# EAGLE design caja_universal (EAGLE 7.7.0)
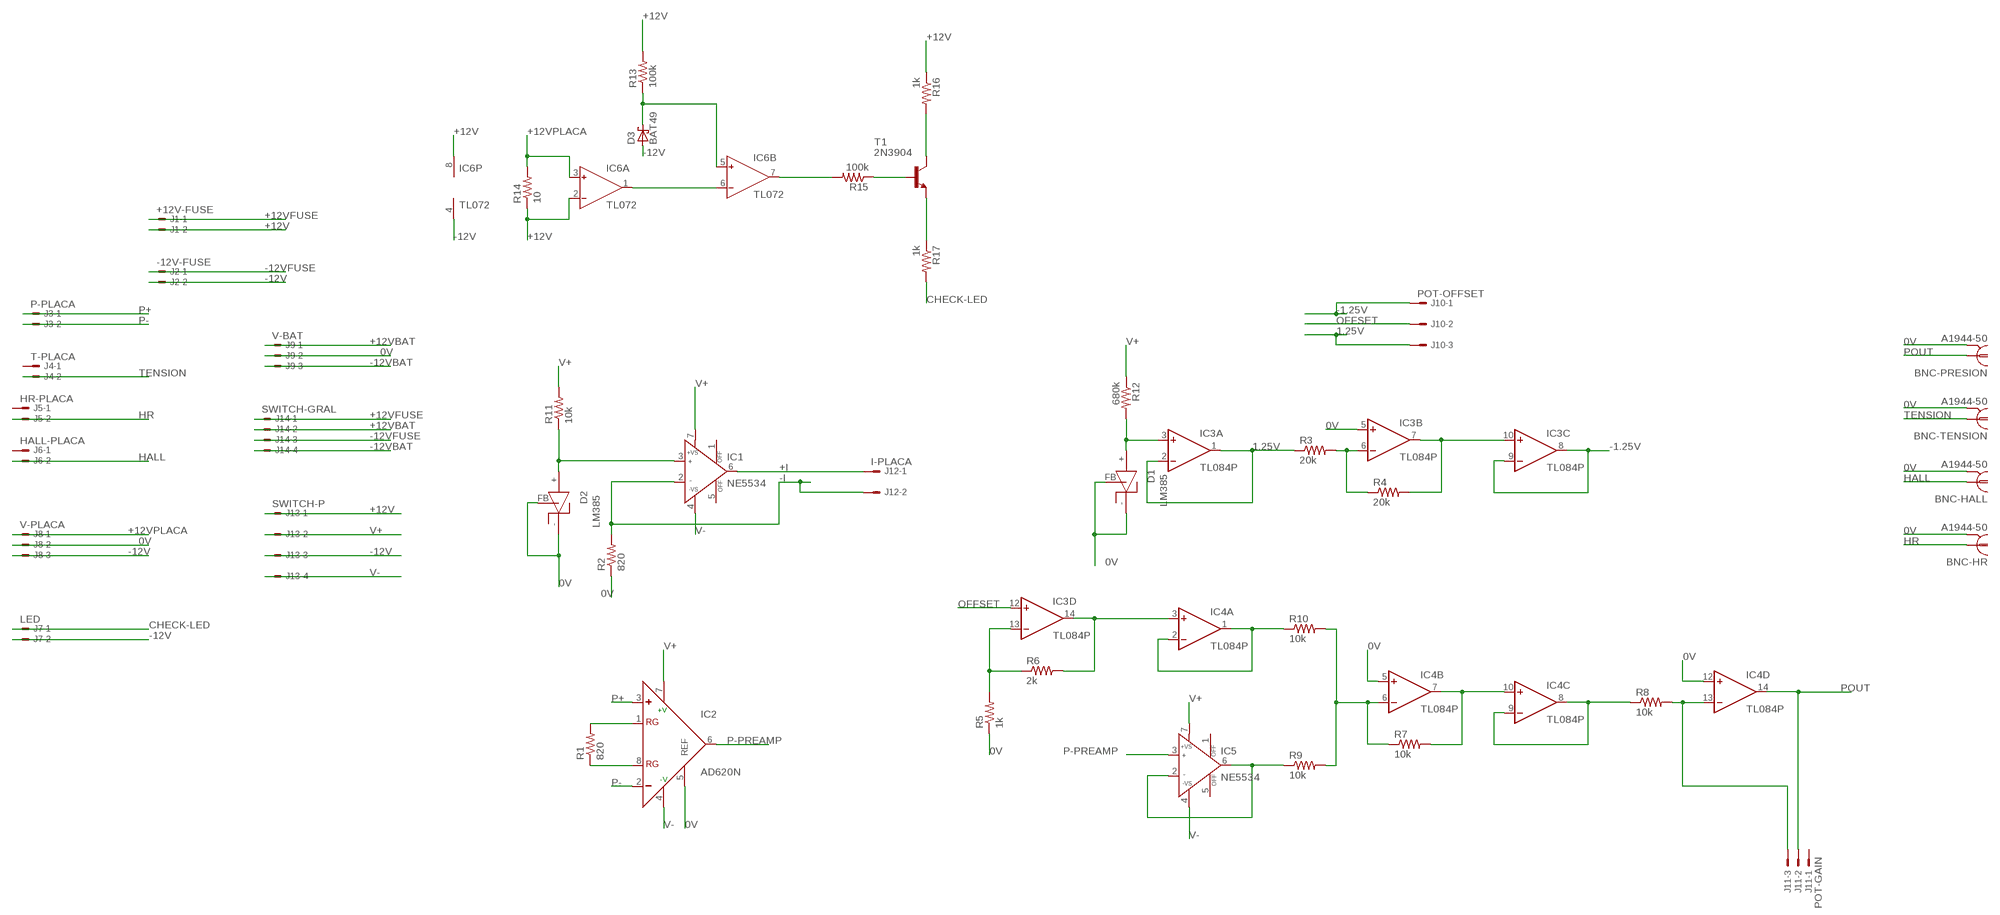
[diagram p0: schematic, sheet 1]

## Parts
BNC-HALL  A1944-50  [A1944]
BNC-HR  A1944-50  [A1944]
BNC-PRESION  A1944-50  [A1944]
BNC-TENSION  A1944-50  [A1944]
D1  LM385  [TO-92]
D2  LM385  [TO-92]
D3  BAT49  [DO41-10]
IC1  NE5534  AD711N  [DIL08]
IC2  AD620N  [DIL08]
IC3  TL084P  [DIL14]
IC4  TL084P  [DIL14]
IC5  NE5534  AD711N  [DIL08]
IC6  TL072  AD826N  [DIL08]
J1  +12V-FUSE  22-27-2021-02  [6410-02]
J2  -12V-FUSE  22-27-2021-02  [6410-02]
J3  P-PLACA  22-27-2021-02  [6410-02]
J4  T-PLACA  22-27-2021-02  [6410-02]
J5  HR-PLACA  22-27-2021-02  [6410-02]
J6  HALL-PLACA  22-27-2021-02  [6410-02]
J7  LED  22-27-2021-02  [6410-02]
J8  V-PLACA  22-27-2031-03  [6410-03]
J9  V-BAT  22-27-2031-03  [6410-03]
J10  POT-OFFSET  22-27-2031-03  [6410-03]
J11  POT-GAIN  22-27-2031-03  [6410-03]
J12  I-PLACA  22-27-2021-02  [6410-02]
J13  SWITCH-P  22-27-2041-04  [6410-04]
J14  SWITCH-GRAL  22-27-2041-04  [6410-04]
R1  820  R-US_0204/7  [0204/7]
R2  820  R-US_0204/7  [0204/7]
R3  20k  R-US_0204/7  [0204/7]
R4  20k  R-US_0204/7  [0204/7]
R5  1k  R-US_0204/7  [0204/7]
R6  2k  R-US_0204/7  [0204/7]
R7  10k  R-US_0204/7  [0204/7]
R8  10k  R-US_0204/7  [0204/7]
R9  10k  R-US_0204/7  [0204/7]
R10  10k  R-US_0204/7  [0204/7]
R11  10k  R-US_0204/7  [0204/7]
R12  680k  R-US_0204/7  [0204/7]
R13  100k  R-US_0204/7  [0204/7]
R14  10  R-US_0204/7  [0204/7]
R15  100k  R-US_0204/7  [0204/7]
R16  1k  R-US_0204/7  [0204/7]
R17  1k  R-US_0204/7  [0204/7]
T1  2N3904  [TO92]

## Nets
0V: BNC-HALL.2 BNC-HALL.3 BNC-HALL.4 BNC-HALL.5 BNC-HR.2 BNC-HR.3 BNC-HR.4 BNC-HR.5 BNC-PRESION.2 BNC-PRESION.3 BNC-PRESION.4 BNC-PRESION.5 BNC-TENSION.2 BNC-TENSION.3 BNC-TENSION.4 BNC-TENSION.5 D1.- D1.FB D2.- D2.FB IC2.5(REF) IC3.5(B:+IN) IC4.5(B:+IN) IC4.12(D:+IN) J8.2 J9.2 R2.1 R5.1
1.25V: IC3.1(A:OUT) IC3.2(A:-IN) J10.3 R3.1
+12V: IC6.2(A:IN-) IC6.8(P:V+) J1.2 J13.1 R13.2 R14.1 R16.1
+12VBAT: J9.1 J14.2
+12VFUSE: J1.1 J14.1
+12VPLACA: IC6.3(A:IN+) J8.1 R14.2
+I: IC1.6(OUT) J12.1
-1.25V: IC3.8(C:OUT) IC3.9(C:-IN) J10.1
-12V: D3.A IC6.4(P:V-) J2.2 J7.2 J8.3 J13.3
-12VBAT: J9.3 J14.4
-12VFUSE: J2.1 J14.3
-I: IC1.2(IN-) J12.2 R2.2
CHECK-LED: J7.1 R17.2
HALL: BNC-HALL.1 J6.2
HR: BNC-HR.1 J5.2
N$3: D2.+ IC1.3(IN+) R11.1
N$4: IC2.1(RG) R1.2
N$5: IC2.8(RG) R1.1
N$6: IC3.6(B:-IN) R3.2 R4.1
N$7: D1.+ IC3.3(A:+IN) R12.2
N$8: IC3.7(B:OUT) IC3.10(C:+IN) R4.2
N$9: IC4.1(A:OUT) IC4.2(A:-IN) R10.1
N$10: IC3.13(D:-IN) R5.2 R6.1
N$11: IC3.14(D:OUT) IC4.3(A:+IN) R6.2
N$12: IC4.6(B:-IN) R7.1 R9.2 R10.2
N$13: IC5.2(IN-) IC5.6(OUT) R9.1
N$14: IC4.7(B:OUT) IC4.10(C:+IN) R7.2
N$15: IC4.8(C:OUT) IC4.9(C:-IN) R8.1
N$16: IC4.13(D:-IN) J11.3 R8.2
N$17: R15.1 T1.2(B)
N$18: R16.2 T1.1(C)
N$19: R17.1 T1.3(E)
N$21: IC6.1(A:OUT) IC6.6(B:IN-)
N$23: D3.C IC6.5(B:IN+) R13.1
N$24: IC6.7(B:OUT) R15.2
OFFSET: IC3.12(D:+IN) J10.2
P+: IC2.3(+) J3.1
P-: IC2.2(-) J3.2
P-PREAMP: IC2.6(OUT) IC5.3(IN+)
POUT: BNC-PRESION.1 IC4.14(D:OUT) J11.2
TENSION: BNC-TENSION.1 J4.2
V+: IC1.7(+VS) IC2.7(+V) IC5.7(+VS) J13.2 R11.2 R12.1
V-: IC1.4(-VS) IC2.4(-V) IC5.4(-VS) J13.4
Unconnected: IC1.1(OFF) IC1.5(OFF) IC5.1(OFF) IC5.5(OFF) J4.1 J5.1 J6.1 J11.1

## Power pins joined to a net without a drawn wire
V+: IC3.4(P:V+) IC4.4(P:V+)
V-: IC3.11(P:V-) IC4.11(P:V-)

## Library data of the parts
BNC-HALL BNC-HR BNC-PRESION BNC-TENSION = con-coax:A1944-50: BNC CONNECTOR 50 Ohm distributor Buerklin 78F2475; OC_FARNELL: unknown; OC_NEWARK: unknown
D1 D2 = lm385:LM385: LM385 LM385 Micropower Voltage Reference
D3 = diode:BAT49: DIODE small signal diode
IC1 IC5 = analog-devices:AD711: Precision, Low Cost, High Speed, BiFET Op Amp Source: http://www.analog.com/static/imported-files/data_sheets/AD711.pdf; MPN: AD711BQ; OC_FARNELL: 9604839; OC_NEWARK: 66F5826
IC2 = analog-devices:AD620: Low Cost, Low Power, Instrumentation Amplifier Source: http://www.analog.com/UploadedFiles/Data_Sheets/37793330023930AD620_e.pdf; MF: ALTERA CORPORATION; MPN: AD620AN; OC_FARNELL: 1523782; OC_NEWARK: 05F7108
IC3 IC4 = linear:TL084: OP AMP
IC6 = analog-devices:AD826: High-Speed, Low-Power Dual Operational Amplifier Source: http://www.analog.com/static/imported-files/data_sheets/AD826.pdf; MF: ALTERA CORPORATION; MPN: AD826ANZ; OC_FARNELL: 1438583; OC_NEWARK: 59K6530
J1-J7 J12 = con-molex:22-?-02: CONNECTOR wire to board 2.54 mm (.1 inch) pitch header; OC_FARNELL: unknown; OC_NEWARK: unknown
J8-J11 = con-molex:22-?-03: CONNECTOR wire to board 2.54 mm (.1 inch) pitch header; OC_FARNELL: unknown; OC_NEWARK: unknown
J13 J14 = con-molex:22-?-04: CONNECTOR wire to board 2.54 mm (.1 inch) pitch header; OC_FARNELL: unknown; OC_NEWARK: unknown
R1-R17 = resistor:R-US_: RESISTOR, American symbol
T1 = transistor:2N3904: NPN TRANSISTOR

## Board
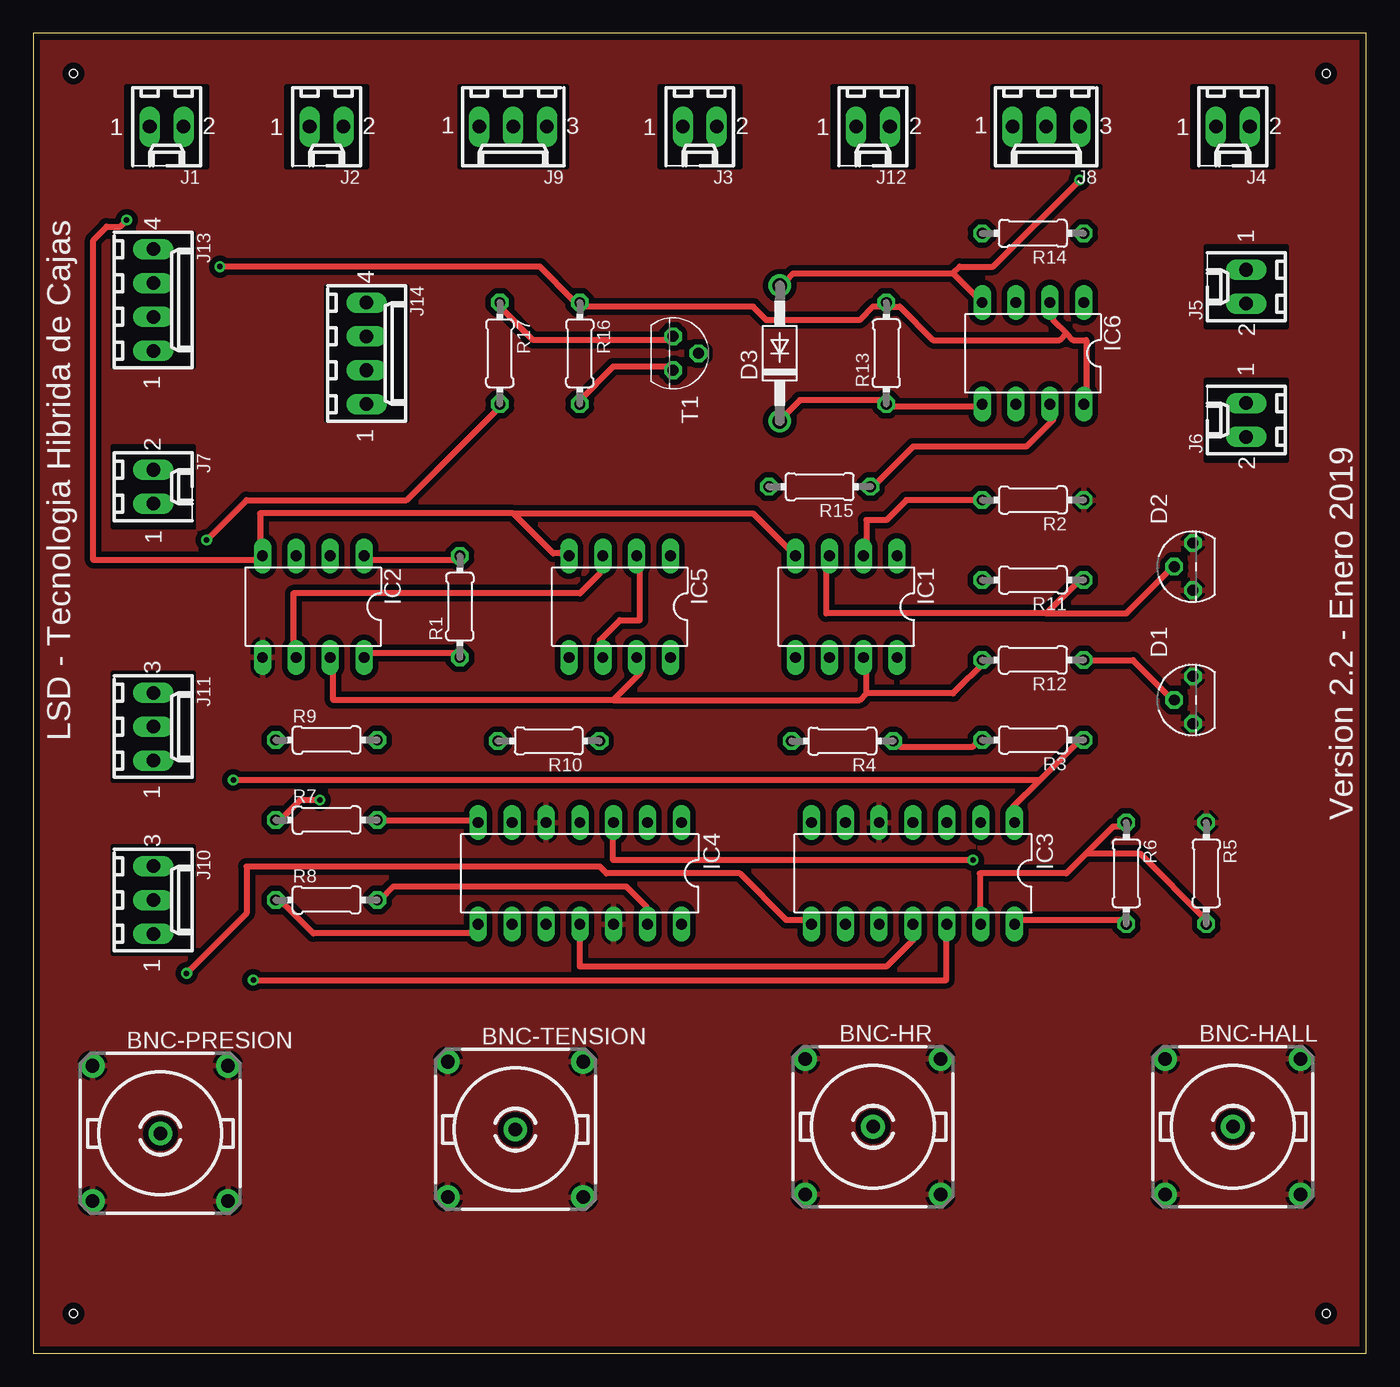
[diagram p1: board, top side]
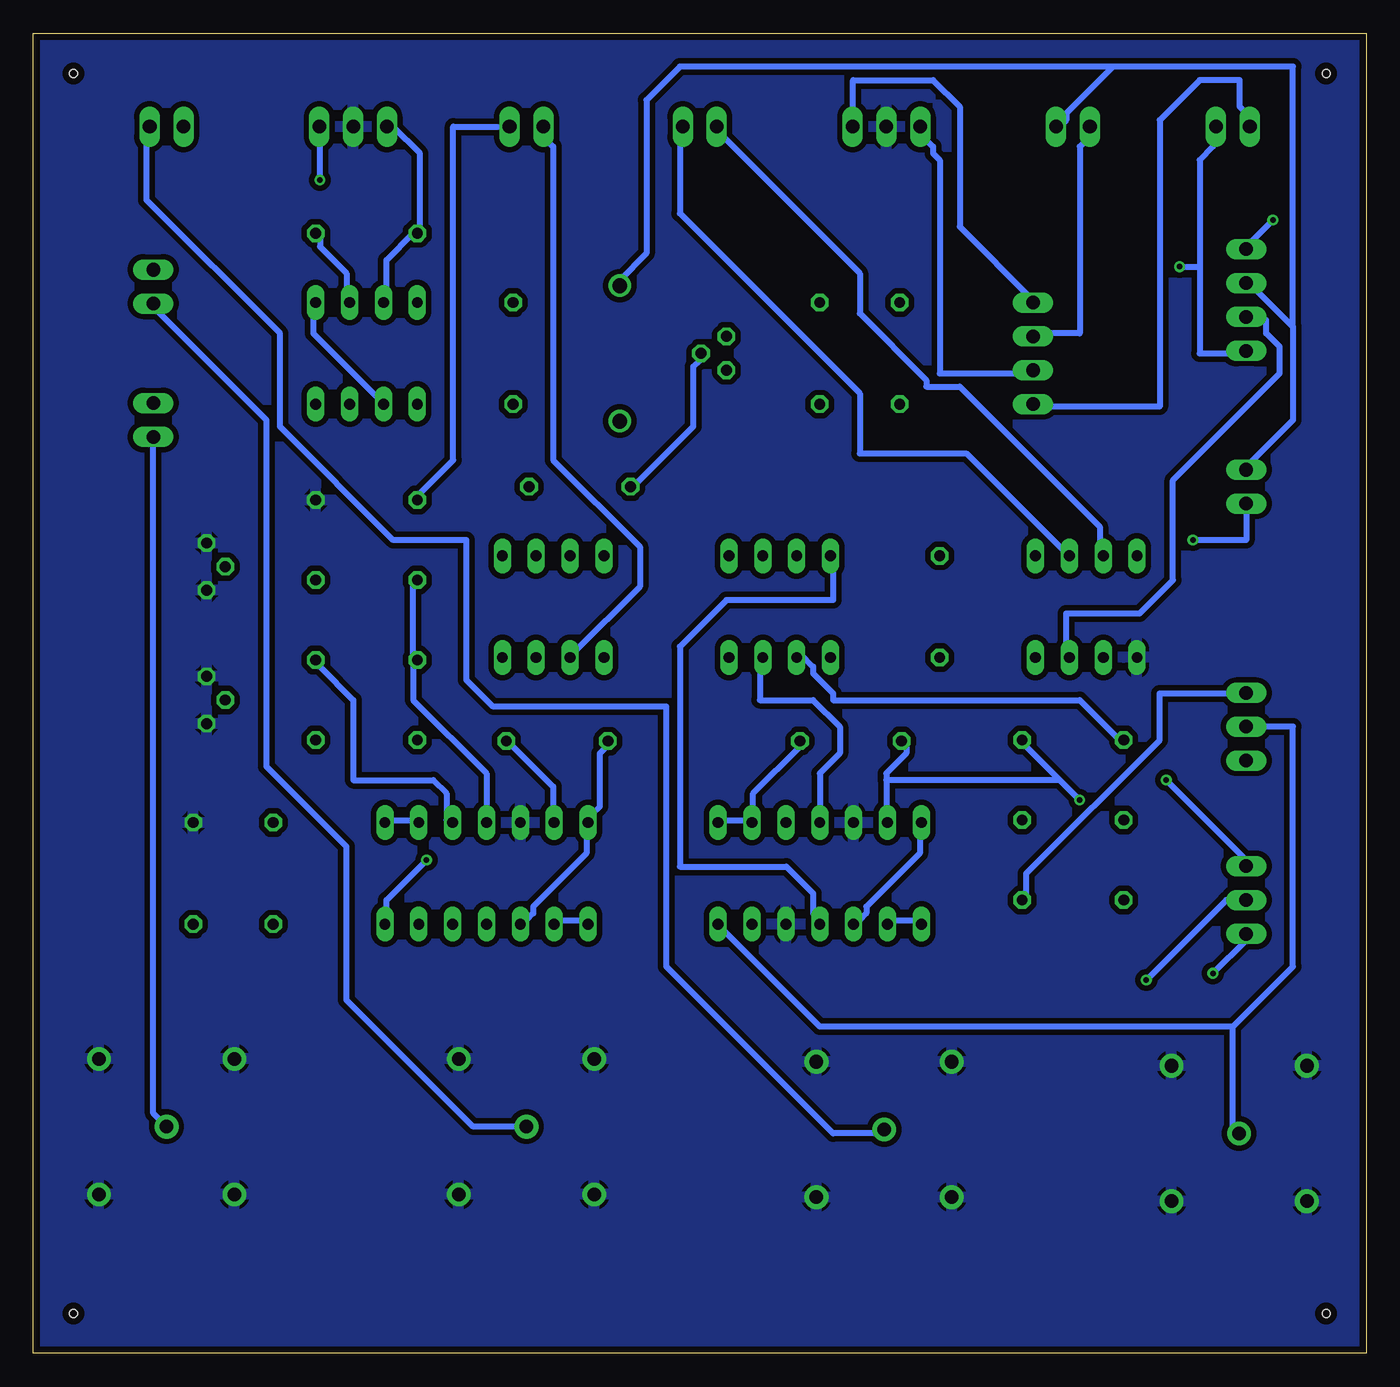
[diagram p2: board, bottom side, seen from below]

Size 100 x 99 mm. Coordinates in mm from the lower left corner, seen from the top.
Outline: 0,0 100,0 100,99 0,99 0,0
Copper layers (1*16): Top 0.035mm / dielectric 1.5mm / Bottom 0.035mm
Design rules "default *": minimum track width 18mil, minimum drill 16mil, track to track 16mil, track to pad 16mil, pad to pad 16mil, via to via 16mil, smd to smd 16mil, copper to edge 20mil, drill to drill 8mil, minimum pad ring 10mil, minimum via ring 8mil, stop-mask expansion 4mil, vias tented up to drill 0mil, thermal gap 10mil
Holes 0.6 mm at 3,3 3,96 97,96 97,3
tRestrict: area 6,74 to 12,84; area 6,62 to 12,68; area 7,89 to 13,95; area 19,89 to 25,95; area 32,89 to 40,95; area 22,70 to 28,80; area 47,89 to 53,95; area 60,89 to 66,95; area 72,89 to 80,95; area 87,89 to 93,95; area 88,77 to 94,83; area 88,67 to 94,73; 2 more areas

### Footprints (pad centres in the part's own frame; a part is rotated, then mirrored left to right if it is on the bottom)
A1944 = drill 1.016 pad 1.778: 1 0,0; 2 5.08,5.08; 3 -5.08,5.08; 4 -5.08,-5.08; 5 5.08,-5.08
TO-92 = drill 0.813 octagon: + 0,1.405; - -1.77,0; FB 1.77,0
DO41-10 = drill 1.118: A 5.08,0; C -5.08,0
DIL08 = drill 0.813 long: 1 -3.81,-3.81; 2 -1.27,-3.81; 3 1.27,-3.81; 4 3.81,-3.81; 5 3.81,3.81; 6 1.27,3.81; 7 -1.27,3.81; 8 -3.81,3.81
DIL14 = drill 0.813 long: 1 -7.62,-3.81; 2 -5.08,-3.81; 3 -2.54,-3.81; 4 0,-3.81; 5 2.54,-3.81; 6 5.08,-3.81; 7 7.62,-3.81; 8 7.62,3.81; 9 5.08,3.81; 10 2.54,3.81; 11 0,3.81; 12 -2.54,3.81; 13 -5.08,3.81; 14 -7.62,3.81
6410-02 = drill 1.016 long: 1 1.27,0; 2 -1.27,0
6410-03 = drill 1.016 long: 1 2.54,0; 2 0,0; 3 -2.54,0
6410-04 = drill 1.016 long: 1 3.81,0; 2 1.27,0; 3 -1.27,0; 4 -3.81,0
0204/7 = drill 0.813 octagon: 1 -3.81,0; 2 3.81,0
TO92 = drill 0.813 octagon: 1 1.27,0; 2 0,1.905; 3 -1.27,0

### Placement (x,y rotation side)
BNC-HALL  90,17 0 top
BNC-HR  63,17 0 top
BNC-PRESION  9.53,16.49 0 top
BNC-TENSION  36.17,16.79 0 top
D1  87,49 90 top
D2  87,59 90 top
D3  56,75 90 top
IC1  61,56 180 top
IC2  21,56 180 top
IC3  66,36 180 top
IC4  41,36 180 top
IC5  44,56 180 top
IC6  75,75 180 top
J1  10,92 180 top
J2  22,92 180 top
J3  50,92 180 top
J4  90,92 180 top
J5  91,80 90 top
J6  91,70 90 top
J7  9,65 270 top
J8  76,92 180 top
J9  36,92 180 top
J10  9,34 270 top
J11  9,47 270 top
J12  63,92 180 top
J13  9,79 270 top
J14  25,75 270 top
R1  32,56 90 top
R2  75,64 180 top
R3  75,46 180 top
R4  60.7,45.92 180 top
R5  88,36 270 top
R6  82,36 270 top
R7  22,40 0 top
R8  22,34 0 top
R9  22,46 0 top
R10  38.67,45.93 180 top
R11  75,58 180 top
R12  75,52 0 top
R13  64,75 90 top
R14  75,84 180 top
R15  59,65 0 top
R16  41,75 270 top
R17  35,75 270 top
T1  48,75 270 top

### Tracks (layer width: path | path; a pad name or v marks a point on that pad's centre or on a via)
0V
  pour Top: -24,-7 124,-6 124,103 -20,111
  pour Bottom: -25,104 123,102 123,-5 -23,-6
1.25V  (via drill 0.41)
  Top 0.457: 75.5,43 73.5,41 73.5,40 IC3.1 | 75.5,43 78.5,46 R3.1 | 75.5,43 v15,43
  Bottom 0.457: IC3.2 71.5,40 73.5,40 IC3.1 | v15,43 9,37 J10.3
+12V  (via drill 0.41)
  Top 0.457: 77.5,76.5 76.5,77.5 76.5,78.5 IC6.2 | 77.5,76.5 78,76 79,76 79,71.5 IC6.8 | 64,78.5 63,78.5 62,77.5 55,77.5 54,78.5 41,78.5 R16.1 41,79 40.5,79 38,81.5 v14,81.5 | 77.5,76.5 77,76 67.5,76 65,78.5 64,78.5 | 64,78.5 R13.2
  Bottom 0.457: 12.5,81.5 12.5,89.5 11.5,90.5 11.5,92 J1.2 | 12.5,81.5 12.5,75 9,75 J13.1 | IC6.2 76.5,79 76.5,81 78.5,83 78.5,84 R14.1 | v14,81.5 12.5,81.5
+12VBAT
  Bottom 0.457: J14.2 25,73.5 32,73.5 32,89.5 32.5,90 32.5,90.5 33,91 33,92 J9.1
+12VFUSE
  Bottom 0.457: J14.1 25,71 15.5,71 15.5,92.5 12.5,95.5 9.5,95.5 9.5,93.5 9,93 9,92 J1.1
+12VPLACA
  Bottom 0.457: IC6.3 73.5,79 73.5,82 71.5,84 R14.2 71,84 71,90 73,92 J8.1
+I
  Bottom 0.457: IC1.6 59.5,52.5 54.5,57.5 54.5,60.5 61,67 61,90.5 61.5,91 61.5,92 J12.1
-1.25V  (via drill 0.41)
  Top 0.457: v11.5,28.5 16,33 16,36.5 42.5,36.5 43,36 53,36 56.5,32.5 58,32.5 IC3.8
  Bottom 0.457: IC3.8 58.5,32.5 60.5,32.5 IC3.9 | v11.5,28.5 9,31 J10.1
-12V  (via drill 0.41)
  Top 0.457: 69,81 IC6.4 | 69,81 57,81 56.5,80.5 56,80.5 D3.A | v78.5,88 72,81.5 69.5,81.5 69,81
  Bottom 0.457: v78.5,88 78.5,92 J8.3 | 5.5,77 5.5,70 9,66.5 J7.2 | 5.5,77 9,80.5 J13.3 | 19,96.5 22.5,93 22.5,92.5 23,92 J2.2 | 19,96.5 5.5,96.5 5.5,77 | 19,96.5 51.5,96.5 54,94 54,82.5 56,80.5 D3.A
-12VBAT
  Bottom 0.457: J14.4 25,79 30.5,84.5 30.5,93.5 32.5,95.5 38.5,95.5 38.5,92 J9.3
-12VFUSE
  Bottom 0.457: J14.3 25,76.5 21.5,76.5 21.5,90.5 21,91 21,92 J2.1
-I
  Top 0.457: R2.2 65.5,64 64,62.5 62.5,62.5 62.5,60 IC1.2
  Bottom 0.457: J12.2 68.5,92 68.5,67 71,64.5 71,64 R2.2
CHECK-LED  (via drill 0.41)
  Top 0.457: v13,61 16,64 28,64 35,71 R17.2
  Bottom 0.457: v13,61 9,61 J7.1
HALL
  Bottom 0.457: J6.2 91,18 BNC-HALL.1
HR
  Bottom 0.457: BNC-HR.1 67,17 76.5,26.5 76.5,38 82.5,44 82.5,70 91,78.5 J5.2
N$3
  Top 0.457: 76,55.5 59.5,55.5 59.5,59.5 IC1.3 | 76,55.5 78.5,58 R11.1 | 76,55.5 82,55.5 85.5,59 D2.+
N$4
  Top 0.457: IC2.1 25,59.5 32,59.5 R1.2
N$5
  Top 0.457: IC2.8 25,52.5 32,52.5 R1.1
N$6
  Top 0.457: R3.2 71,46 70.5,45.5 65,45.5 R4.1
  Bottom 0.457: IC3.6 61,40 61,42.5 64.5,46 R4.1
N$7
  Top 0.457: R12.2 82.5,52 85.5,49 D1.+
  Bottom 0.457: IC3.3 69,40 69,42 70,43 76,43 76,49 78.5,51.5 78.5,52 R12.2
N$8
  Bottom 0.457: IC3.10 63,32.5 62.5,33 62.5,33.5 58.5,37.5 58.5,39.5 IC3.7 58,40 58,40.5 57.5,41 57.5,45 57,45.5 R4.2
N$9
  Bottom 0.457: IC4.1 48.5,40 46.5,40 IC4.2 46,40 46,42 42.5,45.5 R10.1
N$10
  Top 0.457: 79,37.5 81,39.5 82,39.5 R6.1 | 79,37.5 77.5,36 71,36 71,32.5 IC3.13 | 79,37.5 83,37.5 88,32.5 R5.2
N$11  (via drill 0.41)
  Top 0.457: IC3.14 74,32.5 82,32.5 R6.2 | v70.5,37 43.5,37 43.5,39.5 IC4.3
  Bottom 0.457: v70.5,37 73.5,34 73.5,32.5 IC3.14
N$12  (via drill 0.41)
  Top 0.457: v21.5,41.5 20,41.5 18.5,40 R7.1
  Bottom 0.457: 36,43 36,43.5 34.5,45 34.5,45.5 R10.2 | 36,43 36,40 IC4.6 | 23,43 25.5,45.5 25.5,46 R9.2 | 23,43 v21.5,41.5 | 23,43 36,43
N$13
  Top 0.457: IC5.2 45.5,59.5 45.5,55 44,55 42.5,53.5 42.5,52.5 IC5.6
  Bottom 0.457: R9.1 18.5,46 21.5,49 40,49 40,49.5 41.5,51 41.5,51.5 42.5,52.5 IC5.6
N$14
  Top 0.457: R7.2 33,40 IC4.7
  Bottom 0.457: IC4.10 38,32.5 37.5,33 37.5,33.5 33.5,37.5 33.5,39.5 IC4.7
N$15
  Top 0.457: R8.1 18.5,34 21,31.5 33,31.5 33.5,32 IC4.8
  Bottom 0.457: IC4.8 33.5,32.5 35.5,32.5 IC4.9
N$16
  Top 0.457: R8.2 26,34 27,35 44.5,35 46,33.5 46,32.5 IC4.13
  Bottom 0.457: J11.3 9,49.5 15.5,49.5 15.5,46 25.5,36 25.5,34 R8.2
N$17
  Bottom 0.457: R15.1 55,65 50.5,69.5 50.5,74 50,74.5 50,75 T1.2
N$18
  Top 0.457: R16.2 41,71.5 43.5,74 48,74 T1.1
N$19
  Top 0.457: R17.1 35,78.5 37.5,76 48,76 T1.3
N$21
  Bottom 0.457: IC6.6 74,71.5 79,76.5 79,78.5 IC6.1
N$23
  Top 0.457: IC6.5 71,71 64,71 R13.1 64,71.5 57.5,71.5 56,70 D3.C
N$24
  Top 0.457: R15.2 63,65 66,68 74.5,68 76.5,70 76.5,71 IC6.7
OFFSET  (via drill 0.41)
  Top 0.457: v16.5,28 68.5,28 68.5,32 IC3.12
  Bottom 0.457: v16.5,28 10.5,34 J10.2
P+
  Bottom 0.457: IC2.3 20,60 20,62 30.5,72.5 33,72.5 33,73 38,78 38,81 48.5,91.5 48.5,92 J3.1
P-
  Bottom 0.457: IC2.2 22.5,60 30,67.5 38,67.5 38,72 51.5,85.5 51.5,92 J3.2
P-PREAMP
  Top 0.457: IC2.6 19.5,52.5 19.5,57 41,57 42.5,58.5 42.5,59.5 IC5.3
POUT
  Bottom 0.457: 10,24.5 41,24.5 48.5,32 IC4.14 | 10,24.5 10,16.5 BNC-PRESION.1 | J11.2 5.5,47 5.5,29 10,24.5
TENSION
  Bottom 0.457: J4.2 91.5,92 91.5,86.5 81.5,76.5 81.5,69.5 73,61 67.5,61 67.5,50.5 65.5,48.5 52.5,48.5 52.5,29 40,16.5 36.5,16.5 BNC-TENSION.1
V+
  Top 0.457: 62.5,49.5 62.5,52 IC1.7 | 62.5,49.5 69,49.5 71.5,52 R12.1 | 43.5,49 22.5,49 22.5,52 IC2.7 | 43.5,49 45.5,51 45.5,52 IC5.7 | 62.5,49.5 62,49 43.5,49
  Bottom 0.457: IC3.4 66,43.5 71.5,49 71.5,52 | 71.5,52 71.5,58 R11.2 | 71.5,52 R12.1 | IC4.4 41,43.5 39.5,45 39.5,47 41.5,49 45.5,49 45.5,52 IC5.7 | J13.2 9,77.5 7.5,77.5 7.5,76.5 6.5,75.5 6.5,73.5 14.5,65.5 14.5,58 17,55.5 22.5,55.5 22.5,52.5 IC2.7
V-  (via drill 0.41)
  Top 0.457: IC4.11 41,29 64,29 66,31 IC3.11 | 36,63 17,63 17,60 IC2.4 17,59.5 4.5,59.5 4.5,83.5 5.5,84.5 6.5,84.5 v7,85 | 36,63 39,60 40,60 IC5.4 | IC1.4 54,63 36,63
  Bottom 0.457: v7,85 9,83 J13.4 | IC4.11 41,32.5 41.5,33 41.5,34.5 43.5,36.5 51.5,36.5 51.5,53 48,56.5 40,56.5 40,59.5 IC5.4

### Text on the board
tNames: LSD - Tecnologia Hibrida de Cajas | Version 2.2 - Enero 2019